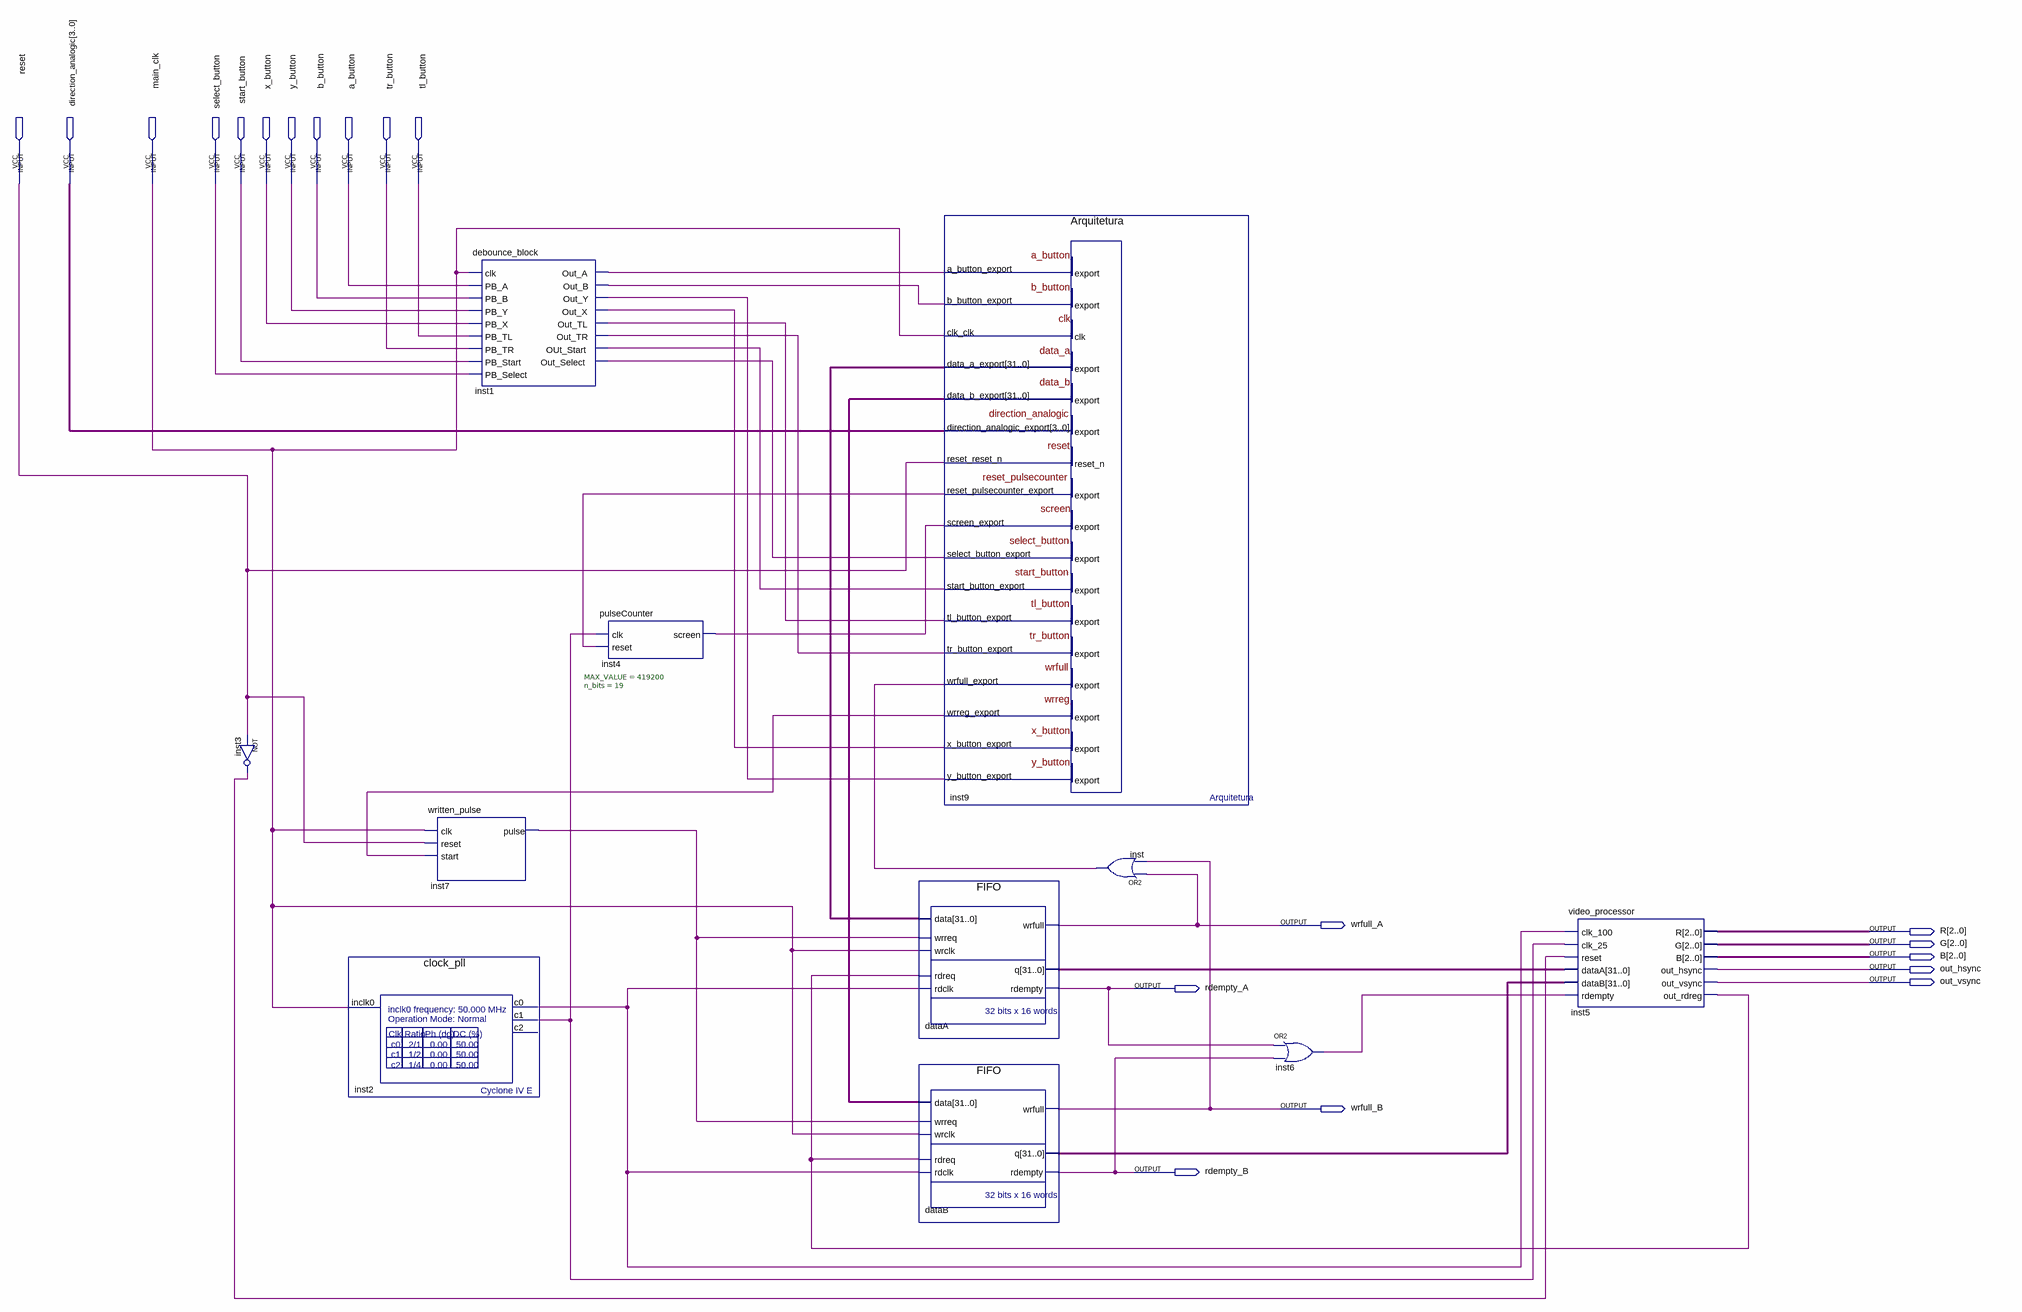
[diagram p0: schematic sheet]
// Quartus schematic ArquiteturaCollenda.bdf as structural Verilog: 11 symbols, 20 pins
module ArquiteturaCollenda (
  input  reset,
  input  [3:0] direction_analogic,
  input  main_clk,
  input  select_button,
  input  start_button,
  input  x_button,
  input  y_button,
  input  b_button,
  input  a_button,
  input  tr_button,
  input  tl_button,
  output wrfull_A,
  output [2:0] R,
  output [2:0] G,
  output [2:0] B,
  output out_hsync,
  output out_vsync,
  output rdempty_A,
  output wrfull_B,
  output rdempty_B
);

  wire inst1_out_a, inst1_out_b, inst1_out_select, inst1_out_start, inst1_out_tl, inst1_out_tr, inst1_out_x,
       inst1_out_y, inst2_c0, inst2_c1, inst3_out, inst4_screen, inst5_out_rdreg, inst6_out, inst7_pulse,
       inst9_reset_pulsecounter_export, inst9_wrreg_export, inst_out;
  wire [31:0] dataA_q, dataB_q, inst9_data_a_export, inst9_data_b_export;

  not inst3 (inst3_out, reset);
  clock_pll inst2 (.inclk0(main_clk), .c0(inst2_c0), .c1(inst2_c1));  // open: c2
  written_pulse inst7 (.clk(main_clk), .reset(reset), .start(inst9_wrreg_export), .pulse(inst7_pulse));
  debounce_block inst1 (
    .clk(main_clk), .PB_A(a_button), .PB_B(b_button), .PB_Y(y_button), .PB_X(x_button), .PB_TL(tl_button),
    .PB_TR(tr_button), .PB_Start(start_button), .PB_Select(select_button), .Out_A(inst1_out_a),
    .Out_B(inst1_out_b), .Out_Y(inst1_out_y), .Out_X(inst1_out_x), .Out_TL(inst1_out_tl),
    .Out_TR(inst1_out_tr), .OUt_Start(inst1_out_start), .Out_Select(inst1_out_select));
  pulseCounter #(.MAX_VALUE(419200), .n_bits(19)) inst4 (
    .clk(inst2_c1), .reset(inst9_reset_pulsecounter_export), .screen(inst4_screen));
  FIFO dataA (
    .data(inst9_data_a_export), .wrreq(inst7_pulse), .wrclk(main_clk), .rdreq(inst5_out_rdreg),
    .rdclk(inst2_c0), .wrfull(wrfull_A), .q(dataA_q), .rdempty(rdempty_A));
  FIFO dataB (
    .data(inst9_data_b_export), .wrreq(inst7_pulse), .wrclk(main_clk), .rdreq(inst5_out_rdreg),
    .rdclk(inst2_c0), .wrfull(wrfull_B), .q(dataB_q), .rdempty(rdempty_B));
  Arquitetura inst9 (
    .a_button_export(inst1_out_a), .b_button_export(inst1_out_b), .clk_clk(main_clk),
    .direction_analogic_export(direction_analogic), .reset_reset_n(reset), .screen_export(inst4_screen),
    .select_button_export(inst1_out_select), .start_button_export(inst1_out_start),
    .tl_button_export(inst1_out_tl), .tr_button_export(inst1_out_tr), .wrfull_export(inst_out),
    .x_button_export(inst1_out_x), .y_button_export(inst1_out_y), .data_a_export(inst9_data_a_export),
    .data_b_export(inst9_data_b_export), .reset_pulsecounter_export(inst9_reset_pulsecounter_export),
    .wrreg_export(inst9_wrreg_export));
  or inst (inst_out, wrfull_A, wrfull_B);
  or inst6 (inst6_out, rdempty_A, rdempty_B);
  video_processor inst5 (
    .clk_100(inst2_c0), .clk_25(inst2_c1), .reset(inst3_out), .dataA(dataA_q), .dataB(dataB_q),
    .rdempty(inst6_out), .R(R), .G(G), .B(B), .out_hsync(out_hsync), .out_vsync(out_vsync),
    .out_rdreg(inst5_out_rdreg));
endmodule
